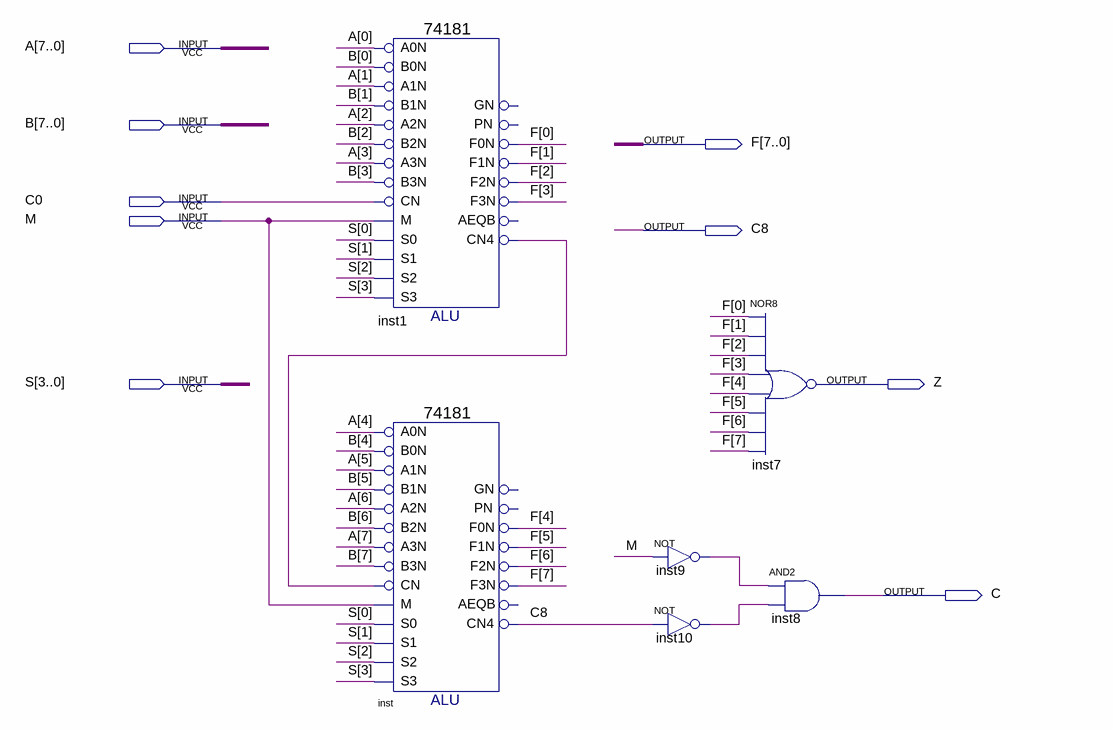
[diagram p0: schematic sheet]
// Quartus schematic ALU8bit.bdf as structural Verilog: 6 symbols, 9 pins
module ALU8bit (
  input  [7:0] A,
  input  [7:0] B,
  input  C0,
  input  M,
  input  [3:0] S,
  output [7:0] F,
  output C8,
  output Z,
  output C
);

  wire inst1_cn4, inst9_out, inst10_out;

  \74181  inst1 (
    .B0N(B[0]), .A0N(A[0]), .A1N(A[1]), .B1N(B[1]), .A3N(A[3]), .B2N(B[2]), .A2N(A[2]), .M(M), .CN(C0),
    .B3N(B[3]), .S2(S[2]), .S1(S[1]), .S0(S[0]), .S3(S[3]), .F3N(F[3]), .F1N(F[1]), .F0N(F[0]),
    .CN4(inst1_cn4), .F2N(F[2]));  // open: PN, GN, AEQB
  \74181  inst (
    .B0N(B[4]), .A0N(A[4]), .A1N(A[5]), .B1N(B[5]), .A3N(A[7]), .B2N(B[6]), .A2N(A[6]), .M(M),
    .CN(inst1_cn4), .B3N(B[7]), .S2(S[2]), .S1(S[1]), .S0(S[0]), .S3(S[3]), .F3N(F[7]), .F1N(F[5]),
    .F0N(F[4]), .CN4(C8), .F2N(F[6]));  // open: PN, GN, AEQB
  not inst9 (inst9_out, M);
  not inst10 (inst10_out, C8);
  nor inst7 (Z, F[0], F[1], F[2], F[3], F[4], F[5], F[6], F[7]);
  and inst8 (C, inst9_out, inst10_out);
endmodule
